# EAGLE design keypad (EAGLE 9.6.2)
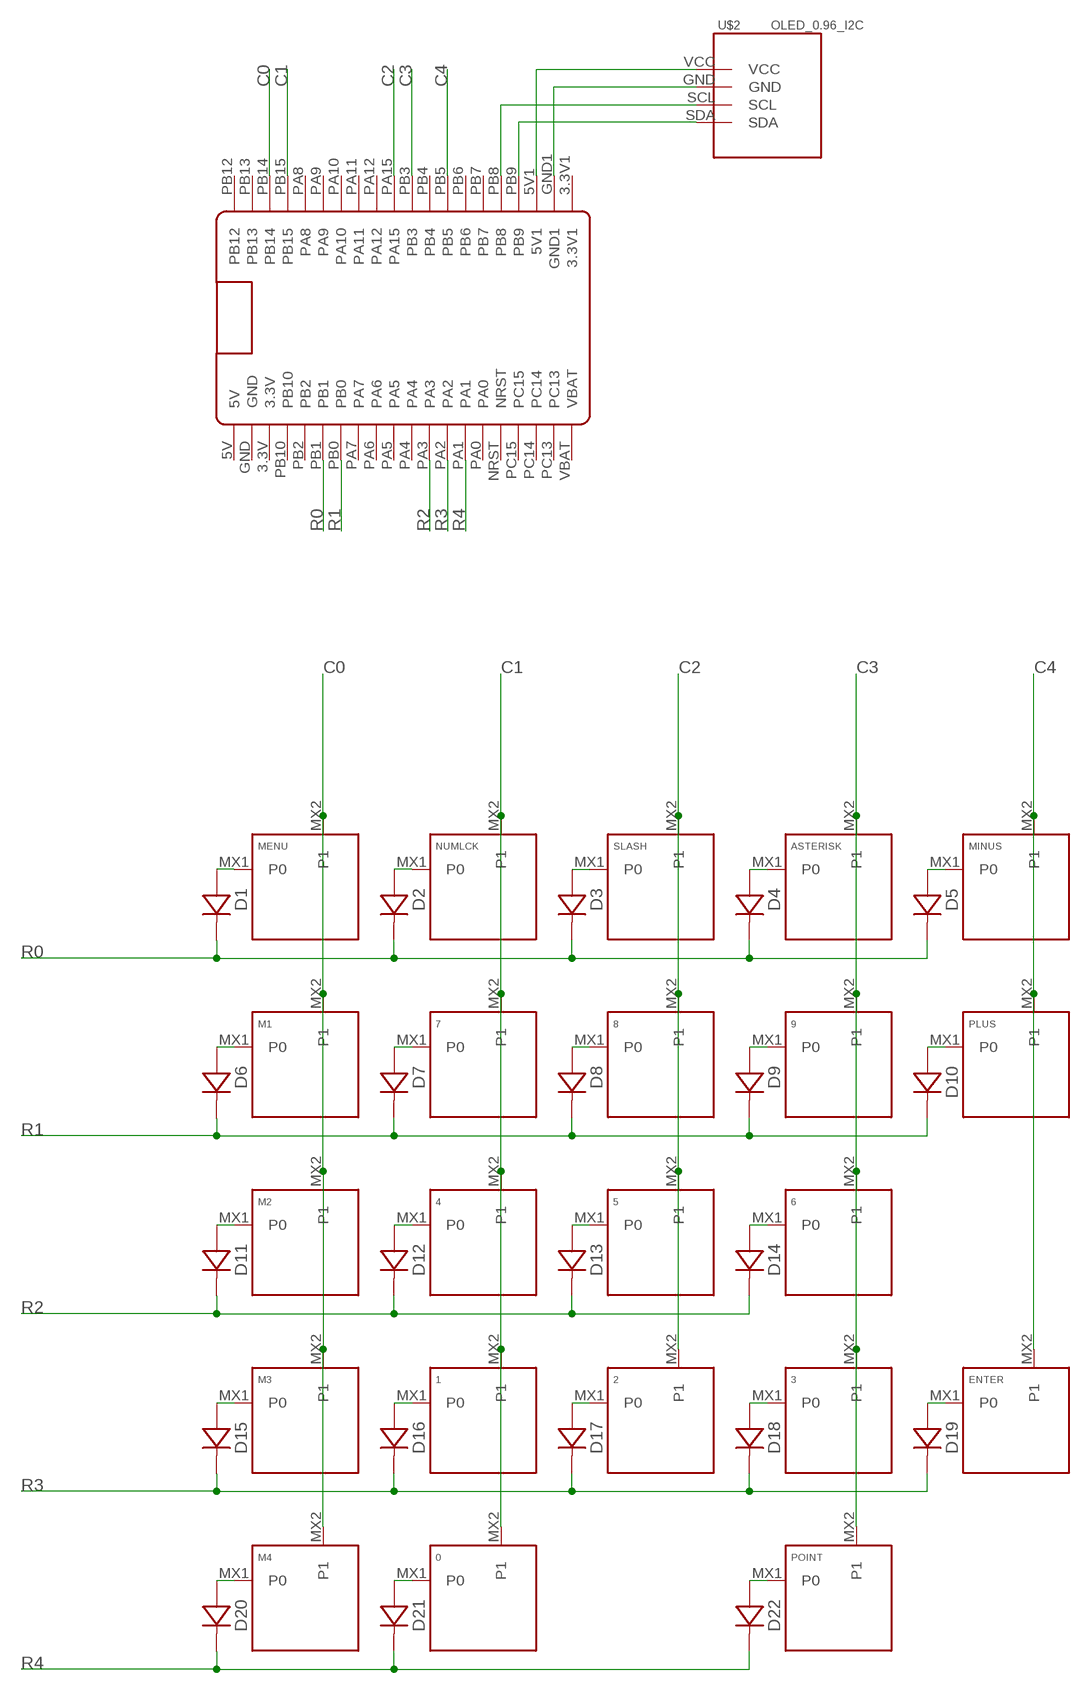
[diagram p0: schematic, sheet 1]

## Parts
0  KEYSWITCH-PLAIN-MX-2U-FLIPPED  [MX-2U-FLIPPED]
1  KEYSWITCH-PLAIN-MX-1U  [MX-1U]
2  KEYSWITCH-PLAIN-MX-1U  [MX-1U]
3  KEYSWITCH-PLAIN-MX-1U  [MX-1U]
4  KEYSWITCH-PLAIN-MX-1U  [MX-1U]
5  KEYSWITCH-PLAIN-MX-1U  [MX-1U]
6  KEYSWITCH-PLAIN-MX-1U  [MX-1U]
7  KEYSWITCH-PLAIN-MX-1U  [MX-1U]
8  KEYSWITCH-PLAIN-MX-1U  [MX-1U]
9  KEYSWITCH-PLAIN-MX-1U  [MX-1U]
ASTERISK  KEYSWITCH-PLAIN-MX-1U  [MX-1U]
D1  DIODE-SOD-123  [SOD-123]
D2  DIODE-SOD-123  [SOD-123]
D3  DIODE-SOD-123  [SOD-123]
D4  DIODE-SOD-123  [SOD-123]
D5  DIODE-SOD-123  [SOD-123]
D6  DIODE-SOD-123  [SOD-123]
D7  DIODE-SOD-123  [SOD-123]
D8  DIODE-SOD-123  [SOD-123]
D9  DIODE-SOD-123  [SOD-123]
D10  DIODE-SOD-123  [SOD-123]
D11  DIODE-SOD-123  [SOD-123]
D12  DIODE-SOD-123  [SOD-123]
D13  DIODE-SOD-123  [SOD-123]
D14  DIODE-SOD-123  [SOD-123]
D15  DIODE-SOD-123  [SOD-123]
D16  DIODE-SOD-123  [SOD-123]
D17  DIODE-SOD-123  [SOD-123]
D18  DIODE-SOD-123  [SOD-123]
D19  DIODE-SOD-123  [SOD-123]
D20  DIODE-SOD-123  [SOD-123]
D21  DIODE-SOD-123  [SOD-123]
D22  DIODE-SOD-123  [SOD-123]
ENTER  KEYSWITCH-PLAIN-MX-2U-ROTATED  [MX-2U-ROTATED]
M1  KEYSWITCH-PLAIN-MX-1U  [MX-1U]
M2  KEYSWITCH-PLAIN-MX-1U  [MX-1U]
M3  KEYSWITCH-PLAIN-MX-1U  [MX-1U]
M4  KEYSWITCH-PLAIN-MX-1U  [MX-1U]
MENU  KEYSWITCH-PLAIN-MX-1U  [MX-1U]
MINUS  KEYSWITCH-PLAIN-MX-1U  [MX-1U]
NUMLCK  KEYSWITCH-PLAIN-MX-1U  [MX-1U]
PLUS  KEYSWITCH-PLAIN-MX-2U-ROTATED  [MX-2U-ROTATED]
POINT  KEYSWITCH-PLAIN-MX-1U  [MX-1U]
SLASH  KEYSWITCH-PLAIN-MX-1U  [MX-1U]
U$1  BLACK_PILL  [BLACK_PILL]
U$2  OLED_0.96_I2C  [OLED_0.96_I2C]

## Nets
C0: M1.MX2(P1) M2.MX2(P1) M3.MX2(P1) M4.MX2(P1) MENU.MX2(P1) U$1.PB14
C1: 0.MX2(P1) 1.MX2(P1) 4.MX2(P1) 7.MX2(P1) NUMLCK.MX2(P1) U$1.PB15
C2: 2.MX2(P1) 5.MX2(P1) 8.MX2(P1) SLASH.MX2(P1) U$1.PA15
C3: 3.MX2(P1) 6.MX2(P1) 9.MX2(P1) ASTERISK.MX2(P1) POINT.MX2(P1) U$1.PB3
C4: ENTER.MX2(P1) MINUS.MX2(P1) PLUS.MX2(P1) U$1.PB5
N$1: D1.A MENU.MX1(P0)
N$2: D2.A NUMLCK.MX1(P0)
N$3: D3.A SLASH.MX1(P0)
N$4: ASTERISK.MX1(P0) D4.A
N$5: D5.A MINUS.MX1(P0)
N$6: D6.A M1.MX1(P0)
N$7: 7.MX1(P0) D7.A
N$8: 8.MX1(P0) D8.A
N$9: 9.MX1(P0) D9.A
N$10: D10.A PLUS.MX1(P0)
N$11: D11.A M2.MX1(P0)
N$12: 4.MX1(P0) D12.A
N$13: 5.MX1(P0) D13.A
N$14: 6.MX1(P0) D14.A
N$15: D15.A M3.MX1(P0)
N$16: 1.MX1(P0) D16.A
N$17: 2.MX1(P0) D17.A
N$18: 3.MX1(P0) D18.A
N$19: D19.A ENTER.MX1(P0)
N$20: D20.A M4.MX1(P0)
N$21: 0.MX1(P0) D21.A
N$22: D22.A POINT.MX1(P0)
N$23: U$1.5V1 U$2.VCC
N$24: U$1.GND1 U$2.GND
N$25: U$1.PB9 U$2.SDA
N$26: U$1.PB8 U$2.SCL
R0: D1.C D2.C D3.C D4.C D5.C U$1.PB1
R1: D6.C D7.C D8.C D9.C D10.C U$1.PB0
R2: D11.C D12.C D13.C D14.C U$1.PA3
R3: D15.C D16.C D17.C D18.C D19.C U$1.PA2
R4: D20.C D21.C D22.C U$1.PA1
Unconnected: U$1.3.3V U$1.3.3V1 U$1.GND U$1.NRST U$1.PA0 U$1.PA4 U$1.PA5 U$1.PA6 U$1.PA7 U$1.PA8 U$1.PA9 U$1.PA10 U$1.PA11 U$1.PA12 U$1.PB2 U$1.PB4 U$1.PB6 U$1.PB7 U$1.PB10 U$1.PB12 U$1.PB13 U$1.PC13 U$1.PC14 U$1.PC15 U$1.VBAT

## Power pins joined to a net without a drawn wire
5V: U$1.5V

## Library data of the parts
0 1-9 ASTERISK ENTER M1-M4 MENU MINUS NUMLCK PLUS POINT SLASH = Keyboard:KEYSWITCH-PLAIN
D1-D22 = Components:DIODE: Standard 1N4148 diode
U$1 = BlackPill:BLACK_PILL: STM32F401CC and STM32f411CE based WeAct Black Pill (rev 3.0)
U$2 = tft_1.8_1.44_oled_0.96:OLED_0.96_I2C

## Board
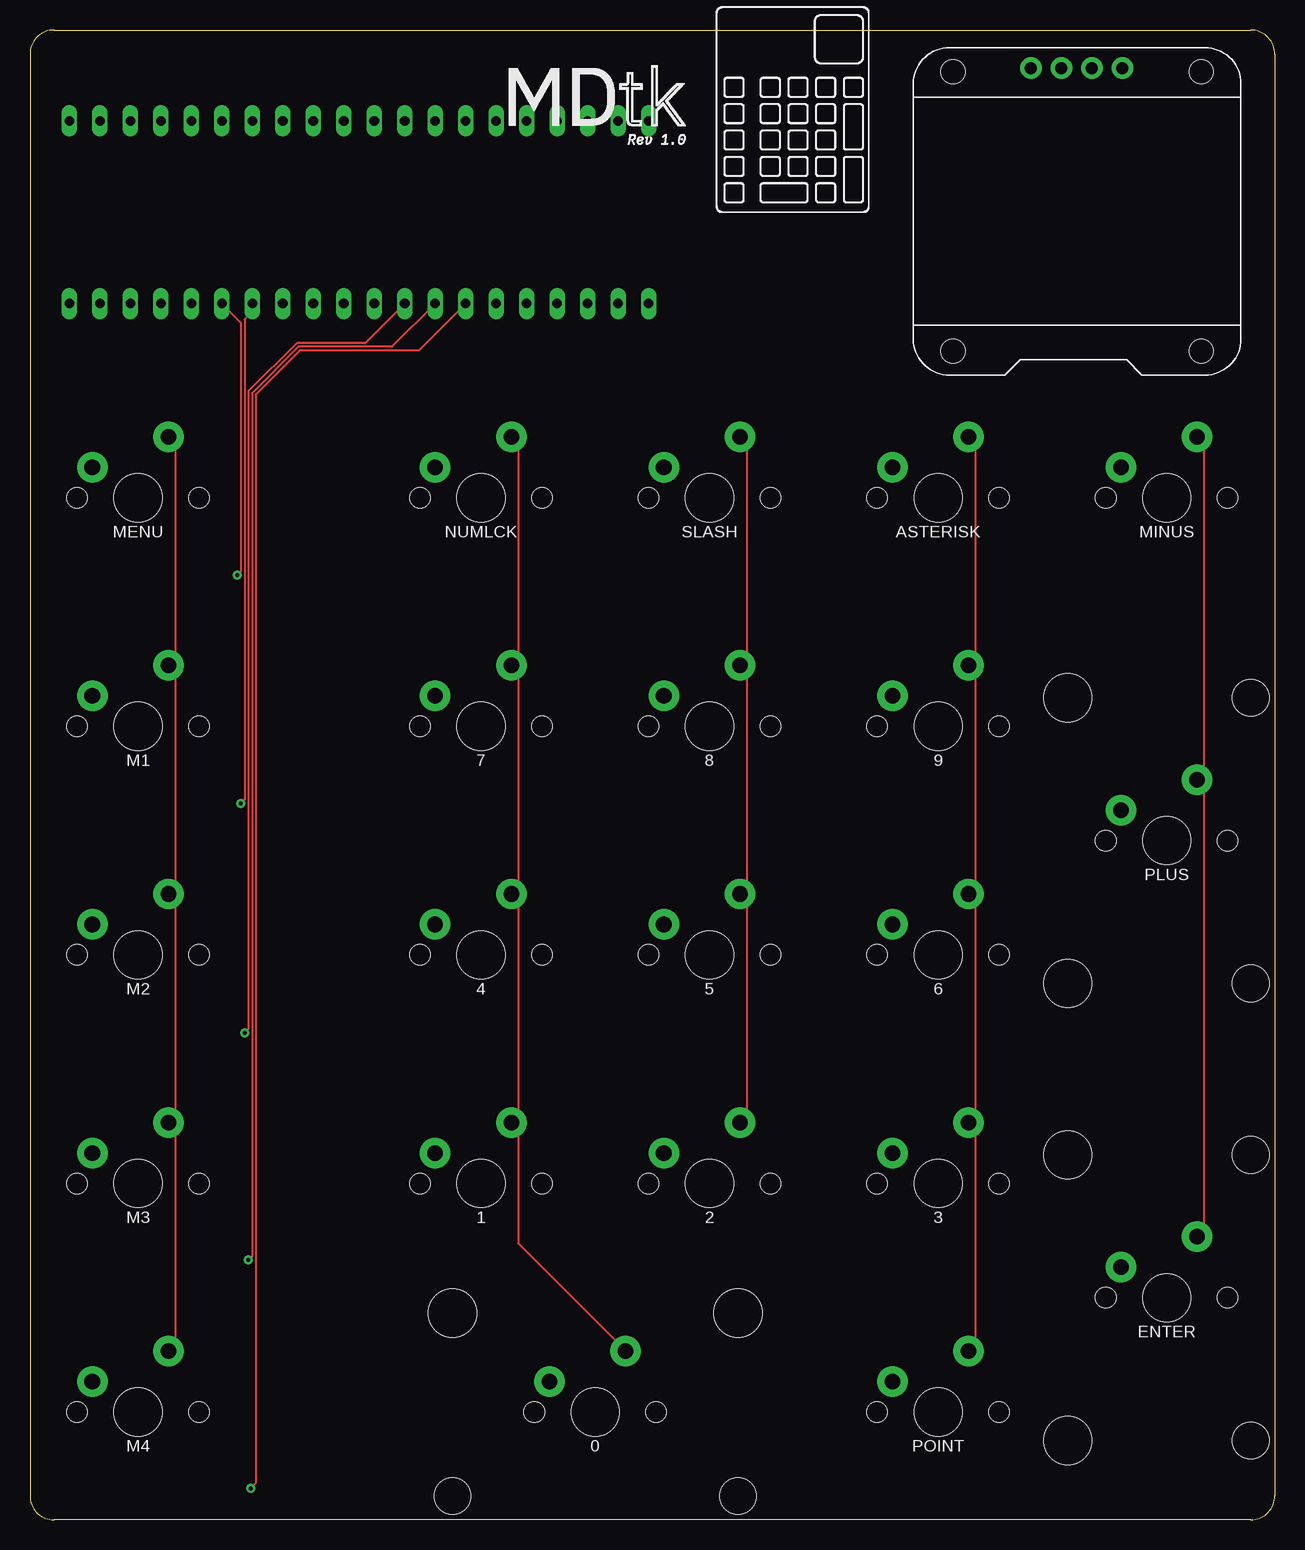
[diagram p1: board, top side]
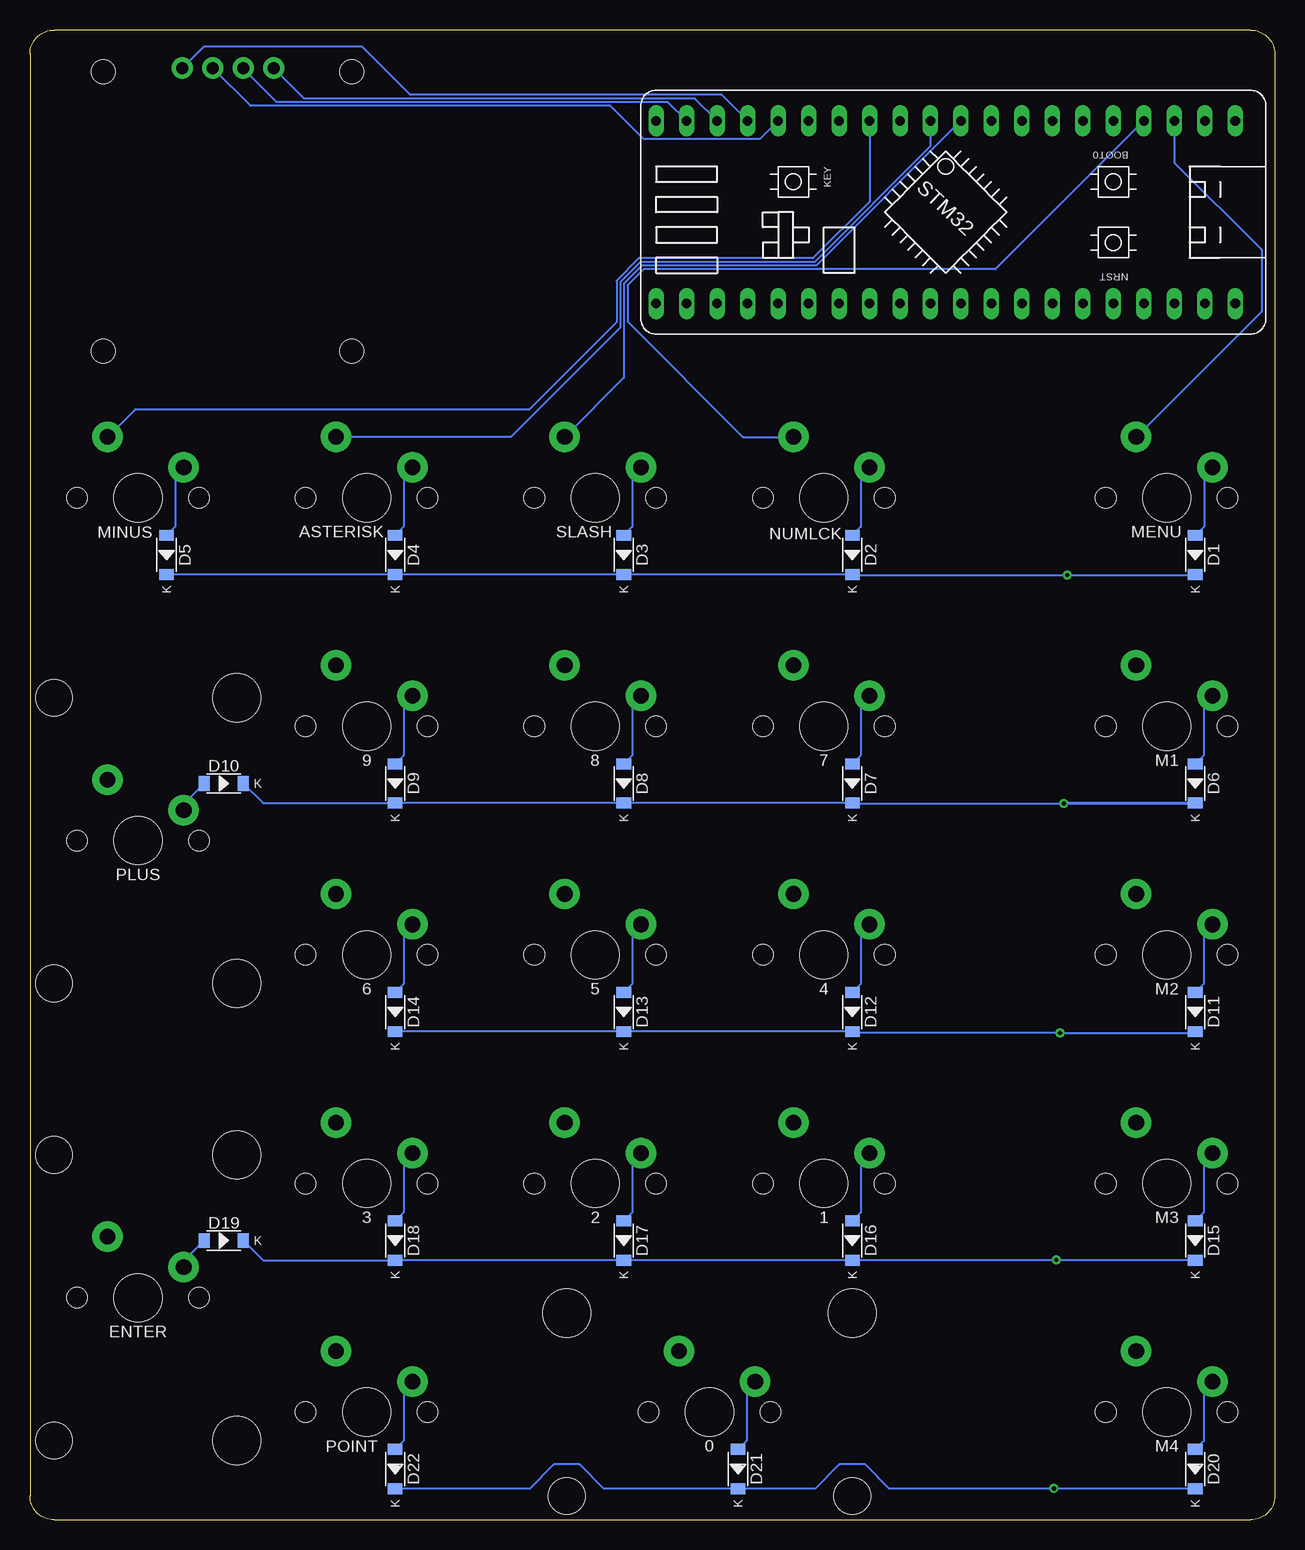
[diagram p2: board, bottom side, seen from below]

Size 103.73 x 124.2 mm. Coordinates in mm from the lower left corner, seen from the top.
Outline: 2,124.2 101.72,124.2 arc-90 103.72,122.2 103.72,2 arc-90 101.72,0 2,0 arc-90 0,2 0,122.2 arc-90 2,124.2
Copper layers (1*16): Top 0.035mm / dielectric 1.5mm / Bottom 0.035mm
Design rules "default": minimum track width 6mil, minimum drill 0.35mm, track to track 6mil, track to pad 6mil, pad to pad 6mil, via to via 6mil, smd to smd 6mil, copper to edge 40mil, drill to drill 6mil, minimum pad ring 10mil, minimum via ring 8mil, stop-mask expansion 4mil, vias tented up to drill 0mil, thermal gap 10mil

### Footprints (pad centres in the part's own frame; a part is rotated, then mirrored left to right if it is on the bottom)
MX-2U-FLIPPED = drill 1.3 pad 2.54: MX1 -3.81,2.54; MX2 2.54,5.08 | hole 4: 0,0; -11.9,8.24; 11.9,8.24 | hole 1.7: -5.08,0; 5.08,0 | hole 3.05: -11.9,-7; 11.9,-7
MX-1U = drill 1.3 pad 2.54: MX1 -3.81,2.54; MX2 2.54,5.08 | hole 4: 0,0 | hole 1.7: -5.08,0; 5.08,0
SOD-123 = smd 0.91 x 1.22: A -1.635,0; C 1.635,0
MX-2U-ROTATED = drill 1.3 pad 2.54: MX1 -3.81,2.54; MX2 2.54,5.08 | hole 4: 0,0; -8.24,-11.9; -8.24,11.9 | hole 1.7: -5.08,0; 5.08,0 | hole 3.05: 7,-11.9; 7,11.9
BLACK_PILL = drill 0.8 long: 3.3V 7.62,10.16; 3.3V1 -7.62,-33.02; 5V 7.62,15.24; 5V1 -7.62,-27.94; GND 7.62,12.7; GND1 -7.62,-30.48; NRST 7.62,-22.86; PA0 7.62,-20.32; PA1 7.62,-17.78; PA2 7.62,-15.24; PA3 7.62,-12.7; PA4 7.62,-10.16; PA5 7.62,-7.62; PA6 7.62,-5.08; PA7 7.62,-2.54; PA8 -7.62,5.08; PA9 -7.62,2.54; PA10 -7.62,0; PA11 -7.62,-2.54; PA12 -7.62,-5.08; PA15 -7.62,-7.62; PB0 7.62,0; PB1 7.62,2.54; PB2 7.62,5.08; PB3 -7.62,-10.16; PB4 -7.62,-12.7; PB5 -7.62,-15.24; PB6 -7.62,-17.78; PB7 -7.62,-20.32; PB8 -7.62,-22.86; PB9 -7.62,-25.4; PB10 7.62,7.62; PB12 -7.62,15.24; PB13 -7.62,12.7; PB14 -7.62,10.16; PB15 -7.62,7.62; PC13 7.62,-30.48; PC14 7.62,-27.94; PC15 7.62,-25.4; VBAT 7.62,-33.02
OLED_0.96_I2C = drill 1 pad 1.778: GND -1.63,11.63; SCL 0.91,11.63; SDA 3.45,11.63; VCC -4.17,11.63 | hole 2: -10.67,-11.97; 10.03,-11.97; 10.03,11.33; -10.67,11.33

### Placement (x,y rotation side)
0  47.1,9 0 top
1  37.58,28.05 0 top
2  56.63,28.05 0 top
3  75.68,28.05 0 top
4  37.58,47.1 0 top
5  56.63,47.1 0 top
6  75.68,47.1 0 top
7  37.58,66.15 0 top
8  56.63,66.15 0 top
9  75.68,66.15 0 top
ASTERISK  75.68,85.2 0 top
D1  6.62,80.44 270 bottom
D2  35.19,80.44 270 bottom
D3  54.24,80.44 270 bottom
D4  73.29,80.44 270 bottom
D5  92.34,80.44 270 bottom
D6  6.62,61.39 270 bottom
D7  35.19,61.39 270 bottom
D8  54.24,61.39 270 bottom
D9  73.29,61.39 270 bottom
D10  87.58,61.39 0 bottom
D11  6.62,42.34 270 bottom
D12  35.19,42.34 270 bottom
D13  54.24,42.34 270 bottom
D14  73.29,42.34 270 bottom
D15  6.62,23.29 270 bottom
D16  35.19,23.29 270 bottom
D17  54.24,23.29 270 bottom
D18  73.29,23.29 270 bottom
D19  87.58,23.29 0 bottom
D20  6.62,4.24 270 bottom
D21  44.72,4.24 270 bottom
D22  73.29,4.24 270 bottom
ENTER  94.73,18.53 0 top
M1  9,66.15 0 top
M2  9,47.1 0 top
M3  9,28.05 0 top
M4  9,9 0 top
MENU  9,85.2 0 top
MINUS  94.73,85.2 0 top
NUMLCK  37.58,85.2 0 top
PLUS  94.73,56.63 0 top
POINT  75.68,9 0 top
SLASH  56.63,85.2 0 top
U$1  18.53,109.01 270 bottom
U$2  87.58,109.4 0 top

### Tracks (layer width: path | path; a pad name or v marks a point on that pad's centre or on a via)
C0
  Top 0.152: MENU.MX2 12.11,89.71 12.11,71.8 M1.MX2 12.09,70.67 12.09,52.73 M2.MX2 12.1,51.61 12.1,33.69 M3.MX2 12.1,32.57 12.1,14.64 M4.MX2
  Bottom 0.152: U$1.PB14 8.36,113.14 1.09,105.87 1.09,100.73 MENU.MX2
C1
  Top 0.152: NUMLCK.MX2 40.69,89.7 40.69,71.81 7.MX2 40.67,70.67 40.67,52.74 4.MX2 40.67,51.62 40.67,33.69 1.MX2 40.67,32.58 40.67,23.05 0.MX2
  Bottom 0.152: U$1.PB15 23.29,104.25 52.6,104.25 53.93,102.92 53.93,99.89 44.32,90.28 NUMLCK.MX2
C2
  Top 0.152: SLASH.MX2 59.73,89.72 59.73,71.79 8.MX2 59.72,70.68 59.72,52.73 5.MX2 59.72,51.62 59.72,33.69 2.MX2
  Bottom 0.152: U$1.PA15 38.22,104.55 52.73,104.55 54.23,103.05 54.23,95.21 SLASH.MX2
C3
  Top 0.152: ASTERISK.MX2 78.77,89.72 78.77,71.79 9.MX2 78.78,70.67 78.78,52.74 6.MX2 78.77,51.62 78.77,33.69 3.MX2 78.77,32.58 78.77,14.63 POINT.MX2
  Bottom 0.152: U$1.PB3 28.68,114.52 38.35,104.86 52.85,104.86 54.54,103.18 54.54,99.4 63.65,90.28 ASTERISK.MX2
C4
  Top 0.152: MINUS.MX2 97.82,89.72 97.82,62.26 PLUS.MX2 97.83,61.14 97.83,24.17 ENTER.MX2
  Bottom 0.152: U$1.PB5 33.76,109.87 38.47,105.16 52.98,105.16 54.84,103.3 54.84,99.84 62.11,92.57 94.97,92.57 MINUS.MX2
N$1
  Bottom 0.152: D1.A 5.88,82.81 5.88,87.05 MENU.MX1
N$2
  Bottom 0.152: D2.A 34.48,82.78 34.48,87.02 NUMLCK.MX1
N$3
  Bottom 0.152: D3.A 53.53,82.78 53.53,87.02 SLASH.MX1
N$4
  Bottom 0.152: D4.A 72.58,82.78 72.58,87.02 ASTERISK.MX1
N$5
  Bottom 0.152: D5.A 91.63,82.78 91.63,87.02 MINUS.MX1
N$6
  Bottom 0.152: D6.A 5.91,63.73 5.91,67.97 M1.MX1
N$7
  Bottom 0.152: D7.A 34.48,63.73 34.48,67.97 7.MX1
N$8
  Bottom 0.152: D8.A 53.53,63.73 53.53,67.97 8.MX1
N$9
  Bottom 0.152: D9.A 72.58,63.73 72.58,67.97 9.MX1
N$10
  Bottom 0.152: PLUS.MX1 90.91,59.69 D10.A
N$11
  Bottom 0.152: D11.A 5.91,44.68 5.91,48.92 M2.MX1
N$12
  Bottom 0.152: D12.A 34.48,44.68 34.48,48.92 4.MX1
N$13
  Bottom 0.152: D13.A 53.53,44.68 53.53,48.92 5.MX1
N$14
  Bottom 0.152: D14.A 72.58,44.68 72.58,48.92 6.MX1
N$15
  Bottom 0.152: D15.A 5.91,25.63 5.91,29.87 M3.MX1
N$16
  Bottom 0.152: D16.A 34.48,25.63 34.48,29.87 1.MX1
N$17
  Bottom 0.152: D17.A 53.53,25.63 53.53,29.87 2.MX1
N$18
  Bottom 0.152: D18.A 72.58,25.63 72.58,29.87 3.MX1
N$19
  Bottom 0.152: ENTER.MX1 90.91,21.59 D19.A
N$20
  Bottom 0.152: D20.A 5.91,6.58 5.91,10.82 M4.MX1
N$21
  Bottom 0.152: D21.A 44.01,6.58 44.01,10.82 0.MX1
N$22
  Bottom 0.152: D22.A 72.58,6.58 72.58,10.82 POINT.MX1
N$23
  Bottom 0.152: U$1.5V1 48.32,118.49 80.87,118.49 U$2.VCC
N$24
  Bottom 0.152: U$1.GND1 50.56,118.19 83.17,118.19 85.95,120.96 U$2.GND
N$25
  Bottom 0.152: U$1.PB9 46.09,118.8 72.02,118.8 76.04,122.82 89.24,122.82 U$2.SDA
N$26
  Bottom 0.152: U$1.PB8 42.92,115.1 52.57,115.1 55.36,117.88 85.34,117.88 U$2.SCL
R0  (via drill 0.35)
  Top 0.152: v17.28,78.76 17.58,79.06 17.58,99.8 U$1.PB1
  Bottom 0.152: D1.C 6.66,78.76 v17.28,78.76 35.15,78.76 D2.C D3.C D4.C D5.C
R1  (via drill 0.35)
  Top 0.152: v17.57,59.72 17.9,60.05 17.9,100.08 18.6,100.78 18.6,101.32 U$1.PB0
  Bottom 0.152: D10.C 84.3,59.74 D9.C D8.C D7.C 35.16,59.72 v17.57,59.72 | v17.57,59.72 6.65,59.72 D6.C 17.32,59.75 17.59,59.75 v17.57,59.72
R2  (via drill 0.35)
  Top 0.152: U$1.PA3 27.92,98.09 22.22,98.09 18.2,94.08 18.2,40.91 v17.89,40.6
  Bottom 0.152: D11.C 6.72,40.6 v17.89,40.6 35.09,40.6 D12.C D13.C D14.C
R3  (via drill 0.35)
  Top 0.152: U$1.PA2 30.15,97.79 22.35,97.79 18.51,93.94 18.51,21.99 v18.19,21.67
  Bottom 0.152: D15.C 6.64,21.67 v18.19,21.67 35.17,21.67 D16.C D17.C D18.C 84.3,21.64 D19.C
R4  (via drill 0.35)
  Top 0.152: U$1.PA1 32.39,97.48 22.48,97.48 18.81,93.81 18.81,3.03 v18.4,2.62
  Bottom 0.152: D22.C 62.1,2.6 60.08,4.62 57.92,4.62 55.9,2.6 D21.C 38.3,2.6 36.28,4.62 34.12,4.62 32.1,2.6 18.42,2.6 v18.4,2.62 18.38,2.6 D20.C